# EAGLE schematic VCF-1-Thomas-Henry (EAGLE 7.6.0)

## Sheet 1 of 2
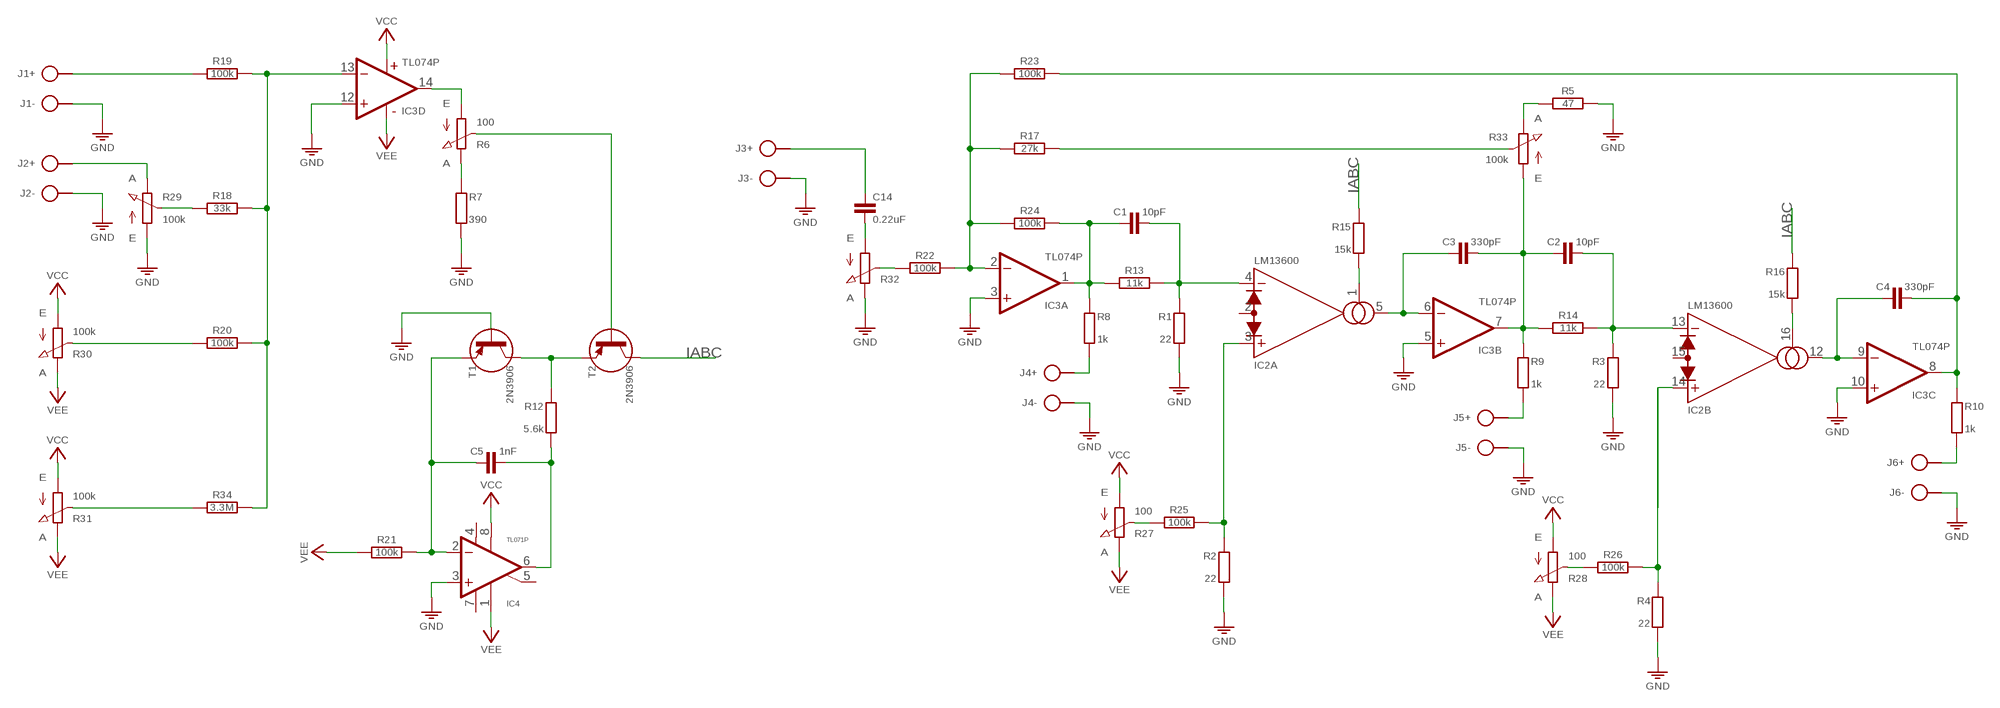
[diagram p0: schematic, sheet 1]

### Parts
C1  10pF  C-H050-020X036  [C050-020X036]
C2  10pF  C-H050-020X036  [C050-020X036]
C3  330pF  C-H050-020X036  [C050-020X036]
C4  330pF  C-H050-020X036  [C050-020X036]
C5  1nF  C-H050-020X036  [C050-020X036]
C14  0.22uF  C050-020X044/V  [C050-020X044/V]
IC2  LM13600  [DIL16]
IC3  TL074P  [DIL14]
IC4  TL071P  [DIL08]
J1  SPAD+--+  [SPAD-+]
J2  SPAD+--+  [SPAD-+]
J3  SPAD+--+  [SPAD-+]
J4  SPAD+--+  [SPAD-+]
J5  SPAD+--+  [SPAD-+]
J6  SPAD+--+  [SPAD-+]
R1  22  R0204/10-V  [0204/10-V]
R2  22  R0204/10-V  [0204/10-V]
R3  22  R0204/10-V  [0204/10-V]
R4  22  R0204/10-V  [0204/10-V]
R5  47  R-H0204/10  [0204/10]
R6  100  POT-V  [POT-V]
R7  390  R0204/10-V  [0204/10-V]
R8  1k  R0204/10-V  [0204/10-V]
R9  1k  R0204/10-V  [0204/10-V]
R10  1k  R0204/10-V  [0204/10-V]
R12  5.6k  R0204/10-V  [0204/10-V]
R13  11k  R-H0204/10  [0204/10]
R14  11k  R-H0204/10  [0204/10]
R15  15k  R0204/10-V  [0204/10-V]
R16  15k  R0204/10-V  [0204/10-V]
R17  27k  R-H0204/10  [0204/10]
R18  33k  R-H0204/10  [0204/10]
R19  100k  R-H0204/10  [0204/10]
R20  100k  R-H0204/10  [0204/10]
R21  100k  R-H0204/10  [0204/10]
R22  100k  R-H0204/10  [0204/10]
R23  100k  R-H0204/10  [0204/10]
R24  100k  R-H0204/10  [0204/10]
R25  100k  R-H0204/10  [0204/10]
R26  100k  R-H0204/10  [0204/10]
R27  100  POT-V  [POT-V]
R28  100  POT-V  [POT-V]
R29  100k  POT  [POT]
R30  100k  POT  [POT]
R31  100k  POT  [POT]
R32  POT  [POT]
R33  100k  POT  [POT]
R34  3.3M  R-H0204/10  [0204/10]
T1  2N3906  [TO92]
T2  2N3906  [TO92]

### Nets
GND: IC3.3(A:+IN) IC3.5(B:+IN) IC3.10(C:+IN) IC3.12(D:+IN) IC4.3(+IN) J1.1 J2.1 J3.1 J4.1 J5.1 J6.1 R1.2 R2.2 R3.2 R4.2 R5.2 R7.2 R29.1(A) R32.3(E) T1.2(B)
IABC: R15.1 R16.1 T2.3(C)
N$1: J1.2 R19.1
N$2: R18.1 R29.2(S)
N$3: J2.2 R29.3(E)
N$4: R20.1 R30.2(S)
N$5: R31.2(S) R34.1
N$6: IC3.13(D:-IN) R18.2 R19.2 R20.2 R34.2
N$7: IC3.14(D:OUT) R6.A
N$8: R6.E R7.1
N$9: R12.1 T1.3(C) T2.1(E)
N$10: C5.2 IC4.6(OUT) R12.2
N$11: C5.1 IC4.2(-IN) R21.2 T1.1(E)
N$12: R6.S T2.2(B)
N$13: R22.1 R32.2(S)
N$14: IC3.2(A:-IN) R17.1 R22.2 R23.1 R24.1
N$15: C1.1 IC3.1(A:OUT) R8.1 R13.1 R24.2
N$16: C1.2 IC2.4(A:-IN) R1.1 R13.2
N$17: J4.2 R8.2
N$18: IC2.1(A:AMP/BIAS) R15.2
N$19: C3.1 IC2.5(A:OUT) IC3.6(B:-IN)
N$20: C2.1 C3.2 IC3.7(B:OUT) R9.1 R14.1 R33.1(A)
N$21: J5.2 R9.2
N$22: C2.2 IC2.13(B:-IN) R3.1 R14.2
N$23: IC2.14(B:+IN)
N$24: R25.1 R27.S
N$25: IC2.3(A:+IN) R2.1 R25.2
N$26: R26.1 R28.S
N$27: R4.1 R26.2
N$28: IC2.16(B:AMP/BIAS) R16.2
N$29: C4.1 IC2.12(B:OUT) IC3.9(C:-IN)
N$30: C4.2 IC3.8(C:OUT) R10.1 R23.2
N$31: J6.2 R10.2
N$32: R17.2 R33.2(S)
N$33: R5.1 R33.3(E)
N$34: C14.1 J3.2
N$35: C14.2 R32.1(A)
VCC: IC3.4(P:V+) IC4.8(OPT) R27.A R28.A R30.1(A) R31.1(A)
VEE: IC3.11(P:V-) IC4.1(ON1) R21.1 R27.E R28.E R30.3(E) R31.3(E)
Unconnected: IC2.2(A:DIODE/BIAS) IC2.7(A*:BUFF/IN) IC2.8(A*:BUFF/OUT) IC2.9(B*:BUFF/IN) IC2.10(B*:BUFF/OUT) IC2.15(B:DIODE/BIAS) IC4.5(ON2)

## Sheet 2 of 2

## Power pins joined to a net without a drawn wire
V+: IC2.11(5:V+) IC4.7(V+)
V-: IC2.6(5:V-) IC4.4(V-)

## Library data of the parts
C1-C5 = c:C-H
C14 = c:C: CAPACITOR, European symbol
IC2 = ic:LM13600
IC3 = ic:TL074: Low-Noise JFET-Input Operational Amplifiers http://www.ti.com/lit/ds/symlink/tl072.pdf
IC4 = ic:TL071: Low-Noise JFET-Input Operational Amplifiers http://www.ti.com/lit/ds/symlink/tl072.pdf
J1-J6 = pad:SPAD+-
R1-R4 R7-R10 R12 R15 R16 = r:R: RESISTOR, European symbol
R5 R13 R14 R17-R26 R34 = r:R-H
R6 R27-R33 = r:POT
T1 T2 = t:2N3906